# EasyEDA Pro project 一体板.epro, schematic Schematic5
Create Date: 2023-07-25; Page Name: P1; Project Name: 独轮车七月v2; Schematic Name: Schematic5; Update Date: 2023-07-25; Company: 嘉立创EDA; Page Size: A4; Version: V1.0
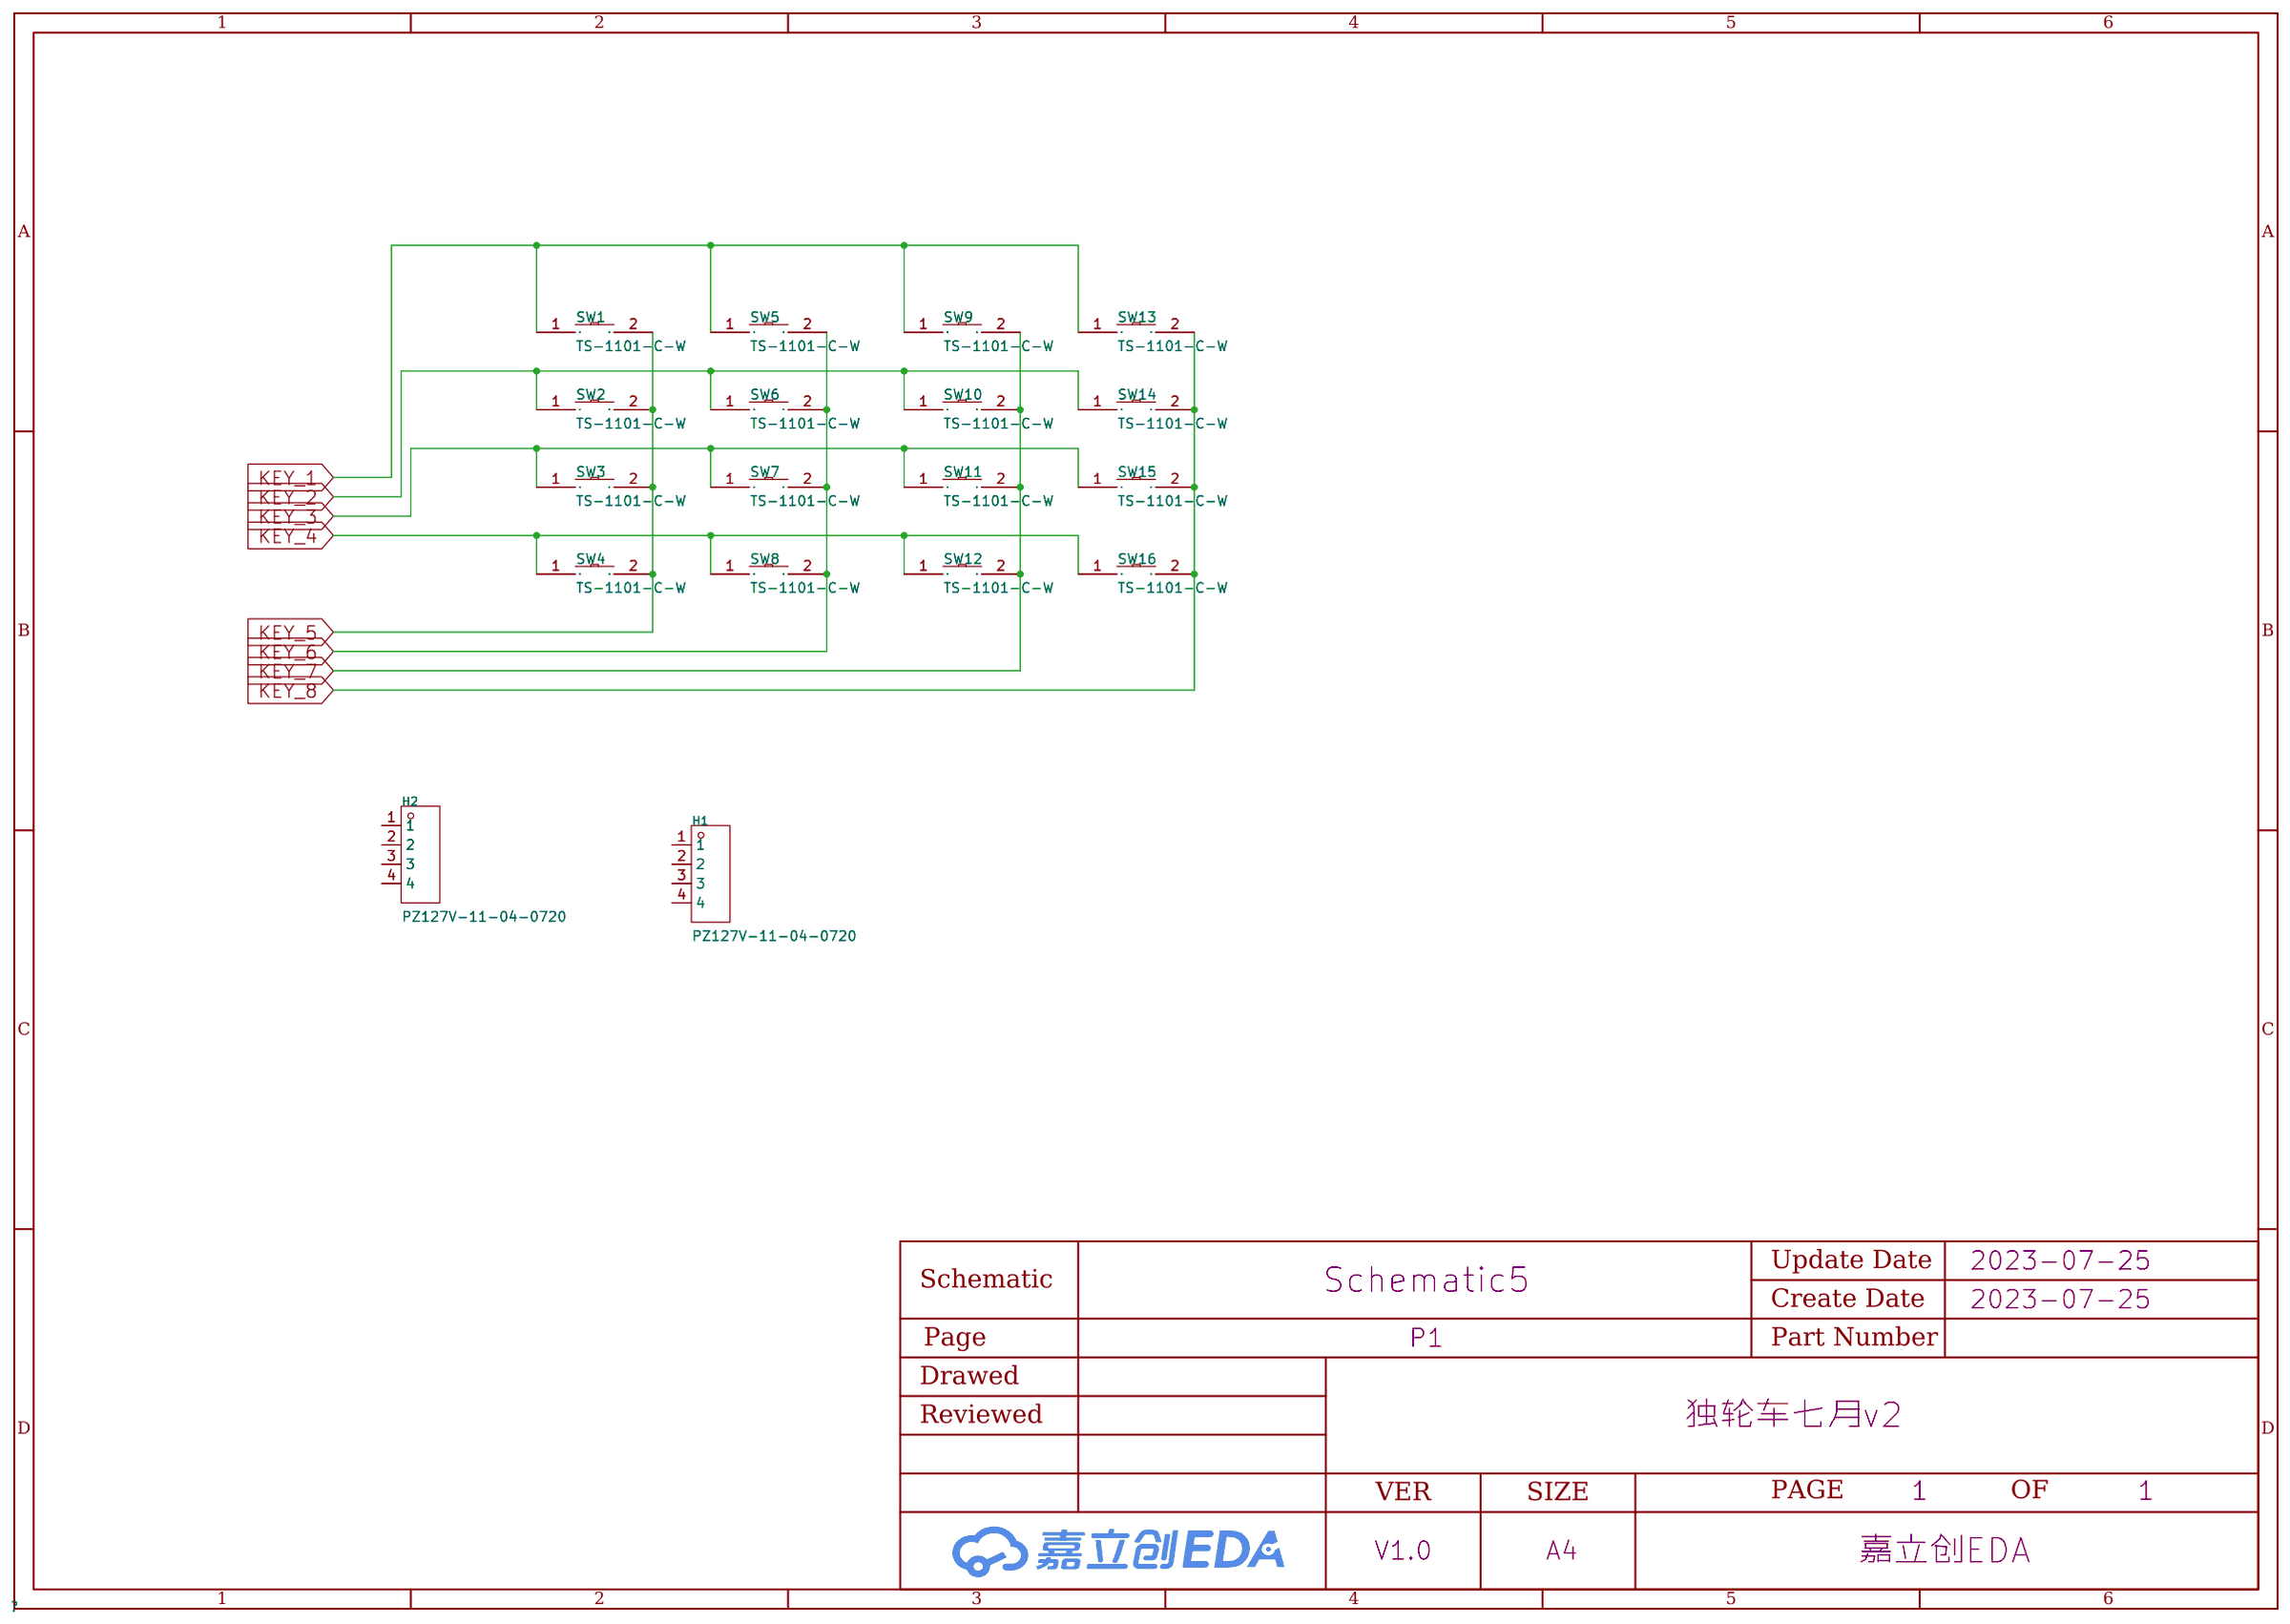
[diagram p6: schematic sheet]

## Parts
H1  PZ127V-11-04-0720  [HDR-TH_4P-P1.27-V-M]
H2  PZ127V-11-04-0720  [HDR-TH_4P-P1.27-V-M]
SW1  TS-1101-C-W  [SW-SMD_L6.0-W3.3-LS8.0]
SW2  TS-1101-C-W  [SW-SMD_L6.0-W3.3-LS8.0]
SW3  TS-1101-C-W  [SW-SMD_L6.0-W3.3-LS8.0]
SW4  TS-1101-C-W  [SW-SMD_L6.0-W3.3-LS8.0]
SW5  TS-1101-C-W  [SW-SMD_L6.0-W3.3-LS8.0]
SW6  TS-1101-C-W  [SW-SMD_L6.0-W3.3-LS8.0]
SW7  TS-1101-C-W  [SW-SMD_L6.0-W3.3-LS8.0]
SW8  TS-1101-C-W  [SW-SMD_L6.0-W3.3-LS8.0]
SW9  TS-1101-C-W  [SW-SMD_L6.0-W3.3-LS8.0]
SW10  TS-1101-C-W  [SW-SMD_L6.0-W3.3-LS8.0]
SW11  TS-1101-C-W  [SW-SMD_L6.0-W3.3-LS8.0]
SW12  TS-1101-C-W  [SW-SMD_L6.0-W3.3-LS8.0]
SW13  TS-1101-C-W  [SW-SMD_L6.0-W3.3-LS8.0]
SW14  TS-1101-C-W  [SW-SMD_L6.0-W3.3-LS8.0]
SW15  TS-1101-C-W  [SW-SMD_L6.0-W3.3-LS8.0]
SW16  TS-1101-C-W  [SW-SMD_L6.0-W3.3-LS8.0]

## Library data of the parts
H1 H2 = PZ127V-11-04-0720: 排数:单排;总PIN位数:4P;间距:1.27mm;插针结构:1x4P;行距:-;安装类型:直插;圆针/方针:-;额定电流:-;额定电压:-;配合针长度:3.9mm;塑高:1mm;端接针长度:2.3mm;触头材质:黄铜;触头镀层:-;工作温度范围:-40℃~+105℃;焊接温度(最大值):-;颜色:黑色;; LCSC Part Name: 1.27mm 1x4P 直插; Supplier Part: C541879; Manufacturer: XFCN(兴飞); Supplier Footprint: 插件,P=1.27mm; JLCPCB Part Class: Extended Part; Datasheet: https://atta.szlcsc.com/upload/public/pdf/source/20200519/C541879_5CD99C402ABEE613587AE88FBA356357.pdf; Supplier: LCSC; Number of Rows: 单排; Number of Pins: 4P; Pitch: 1.27mm; Pin Structure: 1x4P; Mounting Type: 直插; Length of Mating Pin: 3.9mm; Insulation Height: 1mm; Length of End Connection Pin: 2.3mm; Contact Material: 黄铜; Operating Temperature Range: -40℃~+105℃; Color: 黑色
SW1-SW16 = TS-1101-C-W: 触点电流:50mA;额定电压(AC):-;额定电压(DC):12V;额定功率:-;绝缘电阻:-;电路结构:单刀单掷;安装方式:立贴;带灯:无;作用力:260gf;机械寿命:5万次;带支架:否;; LCSC Part Name: 立贴6*3.6*2.5mm轻触开关一型3*6*2.5有白ZDb拉伸白色带淡绿按键卷装; Supplier Part: C318938; Manufacturer: XKBConnectivity(中国星坤); Supplier Footprint: SMD; JLCPCB Part Class: ExtendedPart; Datasheet: https://atta.szlcsc.com/upload/public/pdf/source/20200227/C318938_C2E53B1EEDE37D980A33616AC086DE53.pdf; Supplier: LCSC; Contact Current: 50mA; Voltage Rating (DC): 12V; Circuit: 单刀单掷; Mounting Style: 立贴; Actuator Style: 矩形按钮; Actuator/Cap Color: 白色带淡绿; With Lamp: 无; Operating Force: 260gf; Mechanical Life: 5万次; Operating Temperature: -30℃~+85℃; Switch Length: 6mm; Switch Width: 3.6mm; Switch Height: 2.5mm; Strike Gundam: 否

## Nets
KEY_1: SW1.1 SW5.1 SW9.1 SW13.1
KEY_2: SW2.1 SW6.1 SW10.1 SW14.1
KEY_3: SW3.1 SW7.1 SW11.1 SW15.1
KEY_4: SW4.1 SW8.1 SW12.1 SW16.1
KEY_5: SW1.2 SW2.2 SW3.2 SW4.2
KEY_6: SW5.2 SW6.2 SW7.2 SW8.2
KEY_7: SW9.2 SW10.2 SW11.2 SW12.2
KEY_8: SW13.2 SW14.2 SW15.2 SW16.2

Not connected (* = marked no-connect by the designer): H1 1 2 3 4; H2 1 2 3 4
